# Altium schematic sheet Motor_Driver_Sheet.SchDoc
size 420 x 297 mm; SheetNumber: 6; SheetTotal: 8
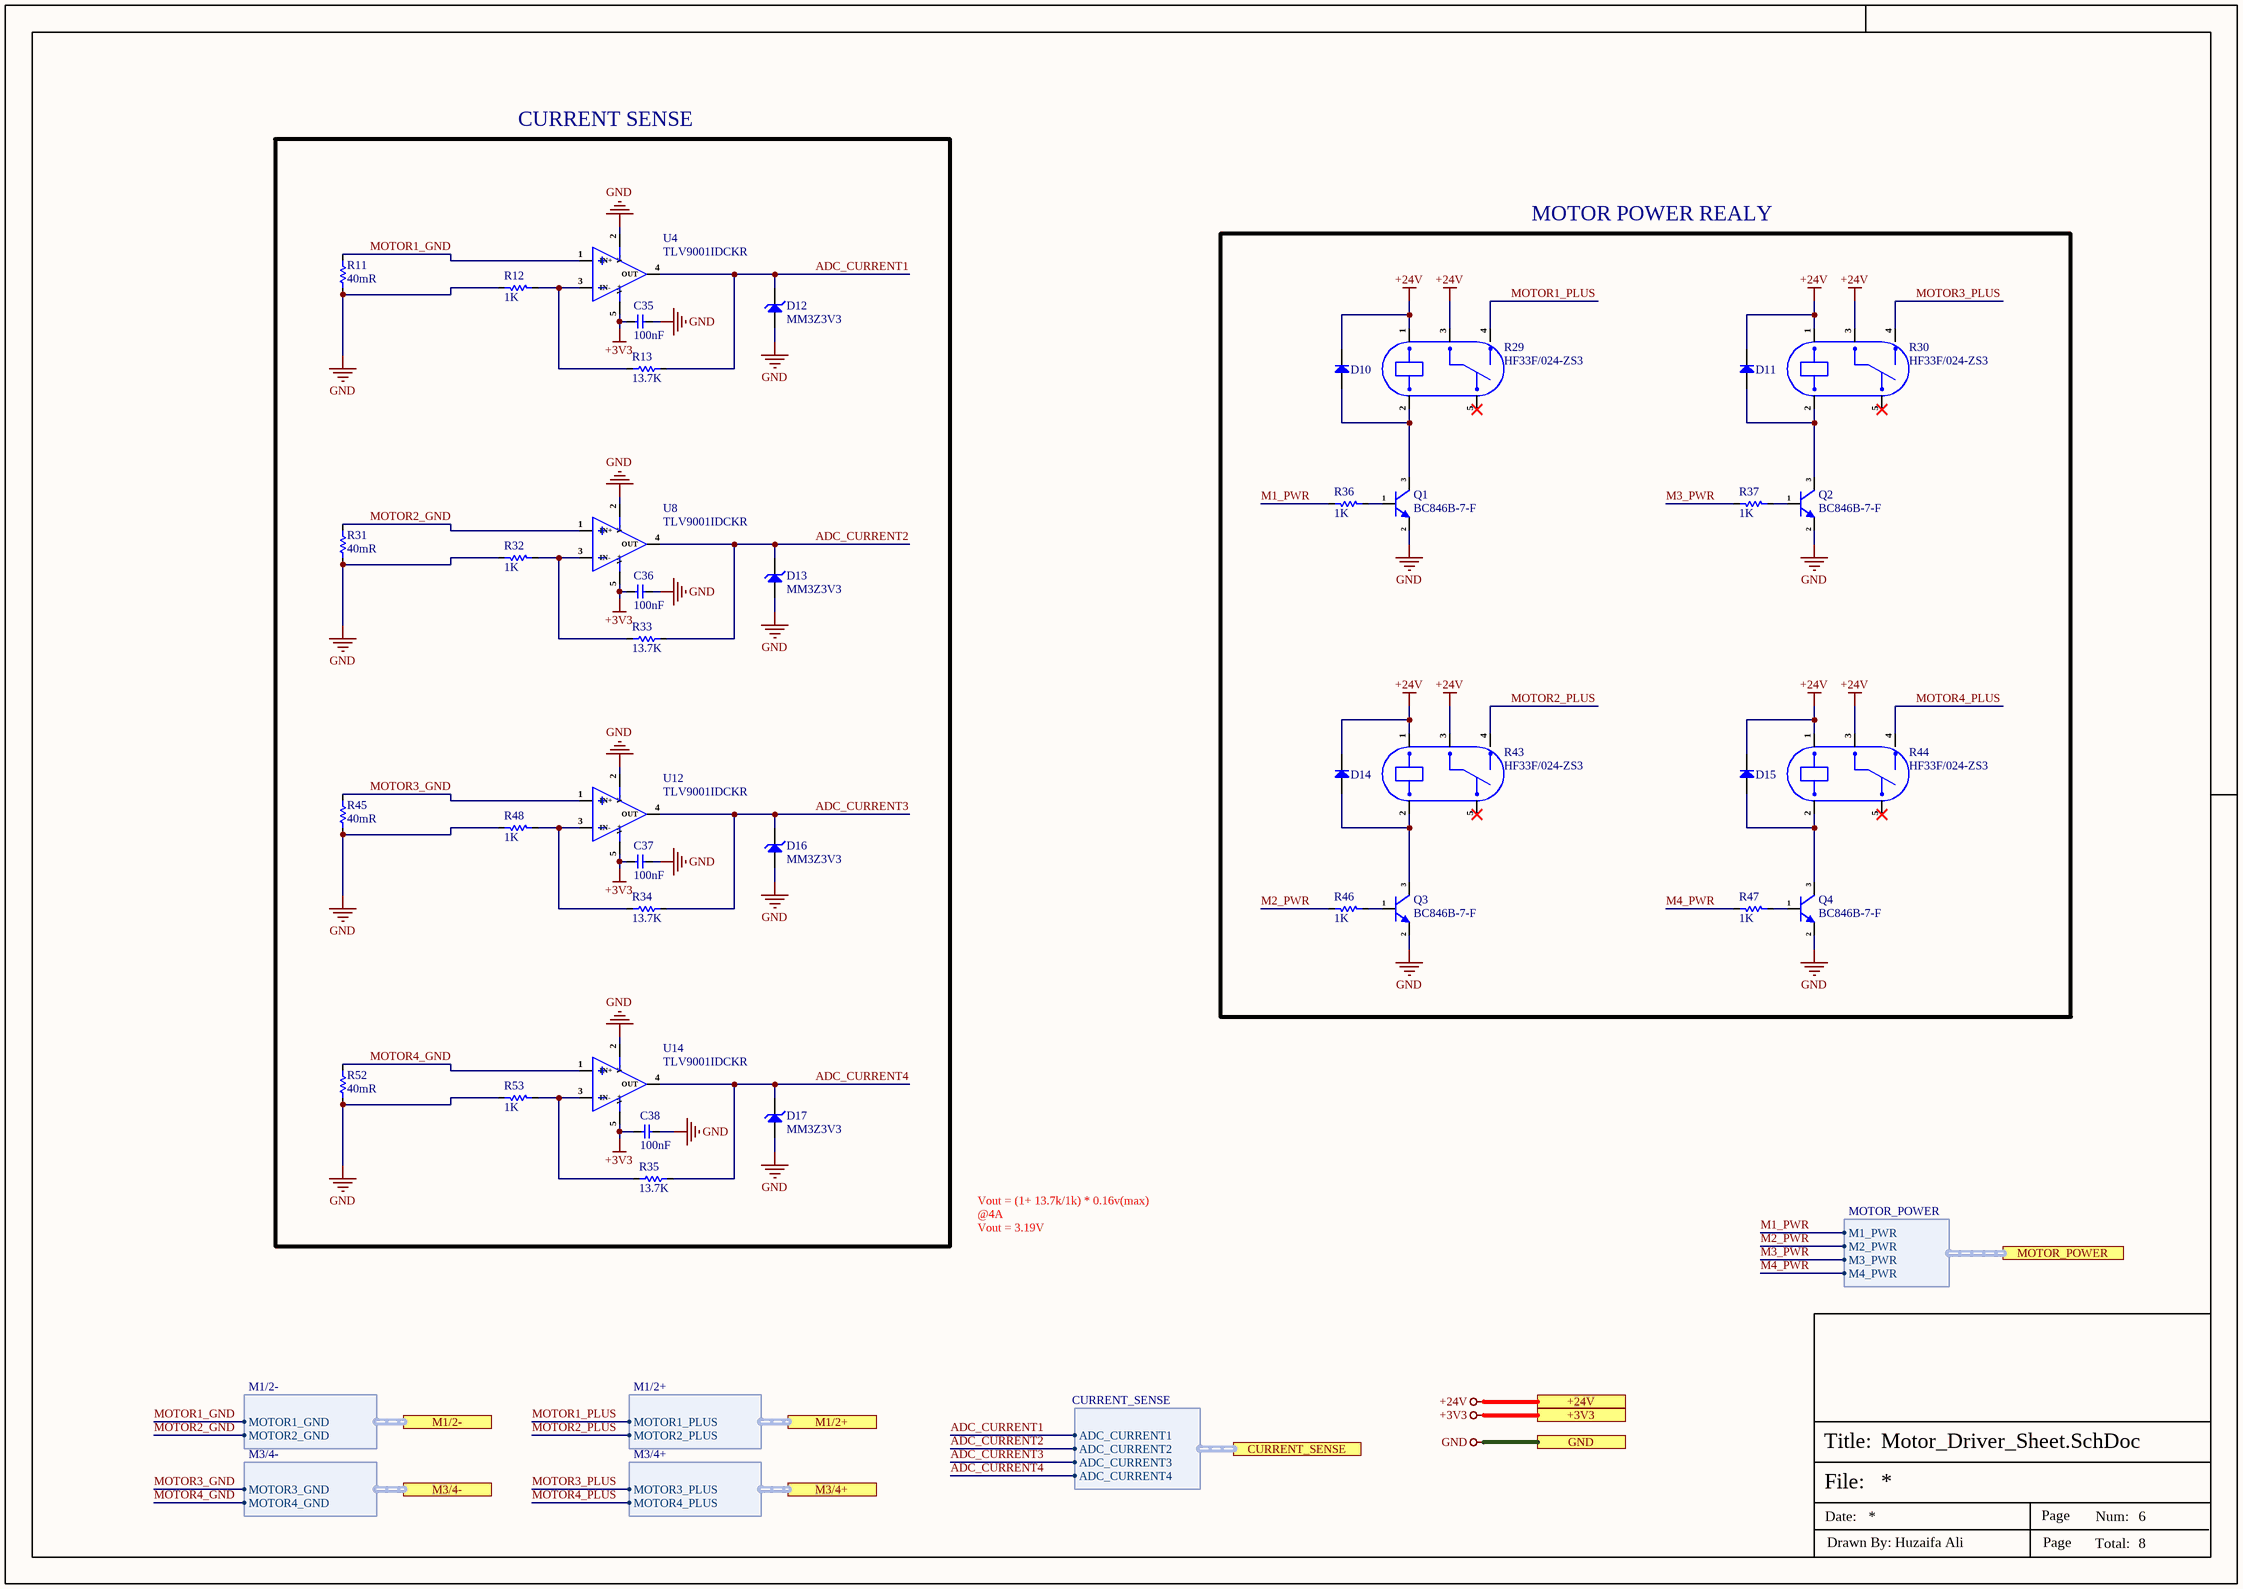
[diagram p0: Motor_Driver_Sheet.SchDoc]

## Parts
C35  100nF  [cap-0402]
C36  100nF  [cap-0402]
C37  100nF  [cap-0402]
C38  100nF  [cap-0402]
D10  1N4148WS-7-F  [SOD-323]  (value not drawn)
D11  1N4148WS-7-F  [SOD-323]  (value not drawn)
D12  MM3Z3V3  [SOD-323]
D13  MM3Z3V3  [SOD-323]
D14  1N4148WS-7-F  [SOD-323]  (value not drawn)
D15  1N4148WS-7-F  [SOD-323]  (value not drawn)
D16  MM3Z3V3  [SOD-323]
D17  MM3Z3V3  [SOD-323]
Q1  BC846B-7-F  [SOT-23]
Q2  BC846B-7-F  [SOT-23]
Q3  BC846B-7-F  [SOT-23]
Q4  BC846B-7-F  [SOT-23]
R11  40mR  [Res-1206]
R12  1K  [Res-0402]
R13  13.7K  [Res-0603]
R29  HF33F/024-ZS3  [HF33F/024-ZS3]
R30  HF33F/024-ZS3  [HF33F/024-ZS3]
R31  40mR  [Res-1206]
R32  1K  [Res-0402]
R33  13.7K  [Res-0603]
R34  13.7K  [Res-0603]
R35  13.7K  [Res-0603]
R36  1K  [Res-0402]
R37  1K  [Res-0402]
R43  HF33F/024-ZS3  [HF33F/024-ZS3]
R44  HF33F/024-ZS3  [HF33F/024-ZS3]
R45  40mR  [Res-1206]
R46  1K  [Res-0402]
R47  1K  [Res-0402]
R48  1K  [Res-0402]
R52  40mR  [Res-1206]
R53  1K  [Res-0402]
U4  TLV9001IDCKR  [SC-70-5]
U8  TLV9001IDCKR  [SC-70-5]
U12  TLV9001IDCKR  [SC-70-5]
U14  TLV9001IDCKR  [SC-70-5]

## Ports
+3V3 (see Top_Sheet[2C], CAN_Sheet[5D], Connector_Sheet1[5D], Connector_Sheet2[3D], Controller_Sheet[2D], Power_Sheet[5D], RS485_RS232_Sheet[5D]), +24V (see Top_Sheet[2B], Power_Sheet[5D]), CURRENT_SENSE (harness CURRENT_SENSE, see Top_Sheet[2C], Controller_Sheet[5D]), GND (see Top_Sheet[2C], CAN_Sheet[5D], Connector_Sheet1[5D], Connector_Sheet2[3D], Controller_Sheet[2D], Power_Sheet[5D], RS485_RS232_Sheet[5D]), M1/2+ (harness M1/2+, see Top_Sheet[2B], Connector_Sheet1[5D]), M1/2- (harness M1/2-, see Top_Sheet[2C], Connector_Sheet1[5D]), M3/4+ (harness M3/4+, see Top_Sheet[2C], Connector_Sheet2[5D]), M3/4- (harness M3/4-, see Top_Sheet[2C], Connector_Sheet2[5D]), MOTOR_POWER (harness MOTOR_POWER, see Top_Sheet[2C], Controller_Sheet[5D])

## Harnesses
M1/2+: MOTOR1_PLUS, MOTOR2_PLUS
M3/4+: MOTOR3_PLUS, MOTOR4_PLUS
M1/2-: MOTOR1_GND, MOTOR2_GND
M3/4-: MOTOR3_GND, MOTOR4_GND
CURRENT_SENSE: ADC_CURRENT1, ADC_CURRENT2, ADC_CURRENT3, ADC_CURRENT4
MOTOR_POWER: M1_PWR, M2_PWR, M3_PWR, M4_PWR

## Nets
+3V3: C35.2 C36.2 C37.2 C38.2 U4.5(V+) U8.5(V+) U12.5(V+) U14.5(V+) ; port +3V3
+24V: D10.1(K) D11.1(K) D14.1(K) D15.1(K) R29.1 R29.3 R30.1 R30.3 R43.1 R43.3 R44.1 R44.3 ; port +24V
GND: C35.1 C36.1 C37.1 C38.1 D12.2(A) D13.2(A) D16.2(A) D17.2(A) Q1.2(E) Q2.2(E) Q3.2(E) Q4.2(E) R11.1 R12.2 R31.1 R32.2 R45.1 R48.2 R52.1 R53.2 U4.2(V-) U8.2(V-) U12.2(V-) U14.2(V-) ; port GND
ADC_CURRENT1: D12.1(K) R13.2 U4.4(OUT) ; port CURRENT_SENSE.ADC_CURRENT1
ADC_CURRENT2: D13.1(K) R33.2 U8.4(OUT) ; port CURRENT_SENSE.ADC_CURRENT2
ADC_CURRENT3: D16.1(K) R34.2 U12.4(OUT) ; port CURRENT_SENSE.ADC_CURRENT3
ADC_CURRENT4: D17.1(K) R35.2 U14.4(OUT) ; port CURRENT_SENSE.ADC_CURRENT4
M1_PWR: R36.2 ; port MOTOR_POWER.M1_PWR
M2_PWR: R46.2 ; port MOTOR_POWER.M2_PWR
M3_PWR: R37.2 ; port MOTOR_POWER.M3_PWR
M4_PWR: R47.2 ; port MOTOR_POWER.M4_PWR
MOTOR1_GND: R11.2 U4.1(IN+) ; port M1/2-.MOTOR1_GND
MOTOR1_PLUS: R29.4 ; port M1/2+.MOTOR1_PLUS
MOTOR2_GND: R31.2 U8.1(IN+) ; port M1/2-.MOTOR2_GND
MOTOR2_PLUS: R43.4 ; port M1/2+.MOTOR2_PLUS
MOTOR3_GND: R45.2 U12.1(IN+) ; port M3/4-.MOTOR3_GND
MOTOR3_PLUS: R30.4 ; port M3/4+.MOTOR3_PLUS
MOTOR4_GND: R52.2 U14.1(IN+) ; port M3/4-.MOTOR4_GND
MOTOR4_PLUS: R44.4 ; port M3/4+.MOTOR4_PLUS
NetD10_2: D10.2(A) Q1.3(C) R29.2
NetD11_2: D11.2(A) Q2.3(C) R30.2
NetD14_2: D14.2(A) Q3.3(C) R43.2
NetD15_2: D15.2(A) Q4.3(C) R44.2
NetQ1_1: Q1.1(B) R36.1
NetQ2_1: Q2.1(B) R37.1
NetQ3_1: Q3.1(B) R46.1
NetQ4_1: Q4.1(B) R47.1
NetR12_1: R12.1 R13.1 U4.3(IN-)
NetR32_1: R32.1 R33.1 U8.3(IN-)
NetR34_1: R34.1 R48.1 U12.3(IN-)
NetR35_1: R35.1 R53.1 U14.3(IN-)

Not connected (* = marked no-connect by the designer): R29 5*; R30 5*; R43 5*; R44 5*

## Notes on the sheet
- CURRENT SENSE
- MOTOR POWER REALY
- Vout = (1+ 13.7k/1k) * 0.16v(max) @4A
  Vout = 3.19V
- File:
- Title:
- Date:
- Page
- Num:
- Total:
- Drawn By: Huzaifa Ali

## Library data of the parts
C35-C38 = C1005X7R1H104KT000F: CAP CER 0.1UF 50V X7R 0402; Manufacturer: TDK; Tolerance: 10%; Voltage: 25V; Item Type: Capacitor; Supplier 1: Avnet; Manufacturer Part Number: C1005X7R1H104KT000F; RoHS: No; Category: Ceramic Capacitors; Dielectric: X7R; Supplier Part Number 1: C1005X7R1H104KT000F; LCSC Part Number: C361198; ComponentLink1Description: LCSC; ComponentLink1URL: https://www.lcsc.com/product-detail/Multilayer-Ceramic-Capacitors-MLCC-SMD-SMT_TDK-C1005X7R1H104KT000F_C361198.html
D10 D11 D14 D15 = 1N4148WS-7-F: DIODE GEN PURP 75V 150MA SOD323; Manufacturer: Diodes; Forward Current: 300mA; Reverse Recovery Time: 4ns; Element Configuration: Single; Forward Voltage: 1.25V; Max Reverse Current: 1uA; Peak Non-Repetitive Surge Current: 2A; Power Dissipation: 200mW; Polarity: Standard; Capacitance: 2pF; Supplier 1: Mouser; Manufacturer Part Number: 1N4148WS-7-F; RoHS: Yes; Category: Rectifier Diodes; Pricing 1: 1=0.19000, 10=0.17500, 50=0.17500, 100=0.09600, 500=0.05900, 1000=0.04000, 3000=0.03000, 9000=0.02600, 10000=0.02600, 24000=0.02300, 45000=0.01900 (USD); Mount: Surface Mount; Number of Pins: 2; Weight: 0.000173oz; Contact Plating: Tin,Matte; Min Operating Temperature: -65°C; Max Operating Temperature: 150°C; Max Repetitive Reverse Voltage (Vrrm): 75V; Max Forward Surge Current (Ifsm): 2A; Max Surge Current: 2A; Packaging: Tape and Reel; Recovery Time: 4ns; Package Quantity: 3000; Average Rectified Current: 150mA; Voltage Rating (DC): 75V; Power Rating: 200mW; Current Rating: 150mA; Output Current: 150mA; Voltage: 75V; Max Reverse Voltage (DC): 75V; Series: -; Reverse Recovery Time-Max: 4ns; Length: 1.8mm; Width: 1.4mm; Height: 1mm; Radiation Hardening: No; REACH SVHC: No SVHC; Lead Free: Lead Free; RoHS Compliant: Yes; ComponentLink1URL: https://datasheet.ciiva.com/1179/ds30097-1179355.pdf?src-supplier=Element14; ComponentLink1Description: https://datasheet.ciiva.com/1179/ds30097-1179355.pdf?src-supplier=Element14; ComponentLink2URL: https://datasheet.ciiva.com/8300/ds30097-8300396.pdf?src-supplier=Avnet; ComponentLink2Description: https://datasheet.ciiva.com/8300/ds30097-8300396.pdf?src-supplier=Avnet; ComponentLink3URL: https://datasheet.ciiva.com/16199/ds30097-16199061.pdf?src-supplier=Future+Electronics; ComponentLink3Description: https://datasheet.ciiva.com/16199/ds30097-16199061.pdf?src-supplier=Future+Electronics; ComponentLink4URL: https://datasheet.ciiva.com/911/ds30097-911742.pdf?src-supplier=Digi-Key; ComponentLink4Description: https://datasheet.ciiva.com/911/ds30097-911742.pdf?src-supplier=Digi-Key; ComponentLink5URL: https://datasheet.ciiva.com/911/ds30097-911743.pdf?src-supplier=Digi-Key; ComponentLink5Description: https://datasheet.ciiva.com/911/ds30097-911743.pdf?src-supplier=Digi-Key; ComponentLink6URL: https://datasheet.ciiva.com/911/ds30097-911741.pdf?src-supplier=Digi-Key; ComponentLink6Description: https://datasheet.ciiva.com/911/ds30097-911741.pdf?src-supplier=Digi-Key; Supplier Part Number 1: 621-1N4148WS-F; LCSC Part Number: C60580; Item Type: Diode
D12 D13 D16 D17 = MM3Z3V3: ±5% Single 3.1V~3.5V 300mW 3.3V SOD-323 Zener Diodes ROHS; Manufacturer: JSMSEMI; Item Type: Diode; ComponentLink1Description: LCSC; ComponentLink1URL: https://www.lcsc.com/product-detail/Zener-Diodes_Shandong-Jingdao-Microelectronics-MM3Z3V3_C123917.html; Manufacturer Part Number: MM3Z3V3; Package: SOD-323; LCSC Part Number: C123917
Q1-Q4 = BC846B-7-F: TRANS NPN 65V 0.1A SOT23-3; Manufacturer: Diodes; Item Type: Transistors; Supplier: Future Electronics; Supplier Part Number: 3888237; Manufacturer Part Number: BC846B-7-F; RoHS: Yes; Category: BJTs; Stock: 4416000; Pricing: 3000=0.0363, 12000=0.0348, 45000=0.0335, 120000=0.0325, 300000=0.0309 (USD); ComponentLink1URL: https://datasheet.ciiva.com/15139/getdatasheetpartid-139519-15139459.pdf?src-supplier=Verical; ComponentLink1Description: https://datasheet.ciiva.com/15139/getdatasheetpartid-139519-15139459.pdf?src-supplier=Verical; ComponentLink2URL: https://datasheet.ciiva.com/22711/1911717-22711685.pdf?src-supplier=Element14; ComponentLink2Description: https://datasheet.ciiva.com/22711/1911717-22711685.pdf?src-supplier=Element14; LCSC Part Number: C183643
R11 R31 R45 R52 = LR1206-21R040F4: 1W 40mΩ Surface Mount Current Sensing Resistors ±50ppm/℃ ±1% 1206 Current Sense Resistors/Shunt Resistors ROHS; Manufacturer: RALEC; Manufacturer Part Number: LR1206-21R040F4; Package: 1206; LCSC Part Number: C2681030; Item Type: Resistor; ComponentLink1Description: LCSC; ComponentLink1URL: https://www.lcsc.com/product-detail/Current-Sense-Resistors-Shunt-Resistors_RALEC-LR1206-21R040F4_C2681030.html
R12 R32 R36 R37 R46-R48 R53 = CRCW04021K00FKEDHP: RES SMD 1K OHM 1% 1/5W 0402; Manufacturer: Vishay Dale; Resistance: 1kR; Temperature Coefficient: 100ppm/°C; Power Rating: 125mW; Voltage Rating: 50V; Supplier 1: Digi-Key; Manufacturer Part Number: CRCW04021K00FKEDHP; Stock 1: 315989; Pricing 1: 1=0.15, 10=0.132, 100=0.0506, 1000=0.02226, 2500=0.01923, 5000=0.0172 (USD); Mount: Surface Mount; Case/Package: 0402; Number of Pins: 2; Contact Plating: Tin; Weight: 2.3E-05oz; Case Code (Imperial): 0402; Case Code (Metric): 1005; Size Code: 0402; Min Operating Temperature: -55°C; Max Operating Temperature: 155°C; Tolerance: 1%; Resistor Type: Thick Film; Package Quantity: 10; Packaging: Tape and Reel; Number of Terminations: 2; Termination: SMD/SMT; Max Power Dissipation: 125mW; Voltage Rating (DC): 50V; Features: Automotive AEC-Q200; Series: CRCW-HP; Construction: Rectangular; Technology: THICK FILM; Resistance Tolerance: 1%; Length: 1mm; Width: 0.5mm; Height: 0.3mm; Depth: 0.5mm; Radiation Hardening: No; REACH SVHC: Unknown; Military Standard: Not; Lead Free: Lead Free; RoHS Compliant: Yes; ComponentLink1URL: http://www.farnell.com/datasheets/2339608.pdf?src-supplier=Element14; ComponentLink1Description: http://www.farnell.com/datasheets/2339608.pdf?src-supplier=Element14; ComponentLink2URL: http://www.vishay.com/docs/20043/crcwhpe3.pdf?src-supplier=Digi-Key; ComponentLink2Description: http://www.vishay.com/docs/20043/crcwhpe3.pdf?src-supplier=Digi-Key; ComponentLink3URL: http://www.mouser.com/ds/2/427/crcwhpe3-46056.pdf?src-supplier=Mouser; ComponentLink3Description: http://www.mouser.com/ds/2/427/crcwhpe3-46056.pdf?src-supplier=Mouser; ComponentLink4URL: http://www.vishay.com/docs/20043/crcwhpe3.pdf?src-supplier=Avnet; ComponentLink4Description: http://www.vishay.com/docs/20043/crcwhpe3.pdf?src-supplier=Avnet; ComponentLink5URL: http://www.vishay.com/docs/20043/crcwhpe3.pdf?src-supplier=Future+Electronics; ComponentLink5Description: http://www.vishay.com/docs/20043/crcwhpe3.pdf?src-supplier=Future+Electronics; Supplier Part Number 1: 541-1.00KYCT-ND; LCSC Part Number: C313354
R13 R33-R35 = AT0603BRD0713K7L: RES SMD 13.7KOHM 0.1% 1/10W 0603; Manufacturer: Yageo; Value: 13.7kR; Max Power Dissipation: 100mW; Temperature Coefficient: 25ppm/°C; Item Type: Resistor; Supplier: Mouser; Supplier Part Number: 603-AT0603BRD0713K7L; Manufacturer Part Number: AT0603BRD0713K7L; RoHS: Yes; Category: Chip SMD Resistors; Stock: 2500; Pricing: 1=0.52, 10=0.396, 50=0.396, 100=0.167, 1000=0.092, 10000=0.075 (USD); Case/Package: 0603; Min Operating Temperature: -55°C; Max Operating Temperature: 155°C; Packaging: Tape and Reel; Number of Terminations: 2; Tolerance: 0.1%; Features: Moisture Resistant,Automotive AEC-Q200,Anti-Sulfur; Series: AT; Length: 0.063inch; Width: 0.032inch; Height: 0.022inch; RoHS Compliant: Yes; ComponentLink1URL: http://www.yageo.com/documents/recent/PYu-AT_51_RoHS_L-3.pdf?src-supplier=Digi-Key; ComponentLink1Description: http://www.yageo.com/documents/recent/PYu-AT_51_RoHS_L-3.pdf?src-supplier=Digi-Key; LCSC Part Number: C855608
R29 R30 R43 R44 = HF33F/024-ZS3: 24V 10A SPDT (1 Form C) Plugin,10.2x20.5mm Power Relays ROHS; Manufacturer: HF(Xiamen Hongfa Electroacoustic); Item Type: Relay; Manufacturer Part Number: HF33F/024-ZS3; Package: Plugin,10.2x20.5mm; LCSC Part Number: C36391; ComponentLink1Description: LCSC; ComponentLink1URL: https://www.lcsc.com/product-detail/Power-Relays_HF-Xiamen-Hongfa-Electroacoustic-HF33F-024-ZS3_C36391.html
U4 U8 U12 U14 = TLV9001IDCKR: IC CMOS 1 CIRCUIT SC70-5; Manufacturer: Texas Instruments; Number of Channels: 1; Slew Rate: 2V/µs; Gain Bandwidth Product: 1MHz; Input Bias Current: 5pA; Input Offset Voltage (Vos): 400uV; Operating Supply Current: 60uA; Output Current per Channel: 40mA; Supplier: Mouser; Supplier Part Number: 595-TLV9001IDCKR; Manufacturer Part Number: TLV9001IDCKR; RoHS: Yes; Item Type: IC; Stock: 13115; Pricing: 1=0.47, 10=0.348, 50=0.348, 100=0.194, 1000=0.146, 10000=0.117 (USD); Mounting Technology: Surface Mount; Min Operating Temperature: -40°C; Max Operating Temperature: 125°C; Packaging: Cut Tape; Number of Circuits: 1; Series: -; RoHS Compliant: Yes; ComponentLink1URL: http://www.ti.com/lit/ds/symlink/tlv9001.pdf?src-supplier=Digikey; ComponentLink1Description: http://www.ti.com/lit/ds/symlink/tlv9001.pdf?src-supplier=Digikey; LCSC Part Number: C398362